# EAGLE design BehaviorShield-DB9-USB (EAGLE 9.2.2)
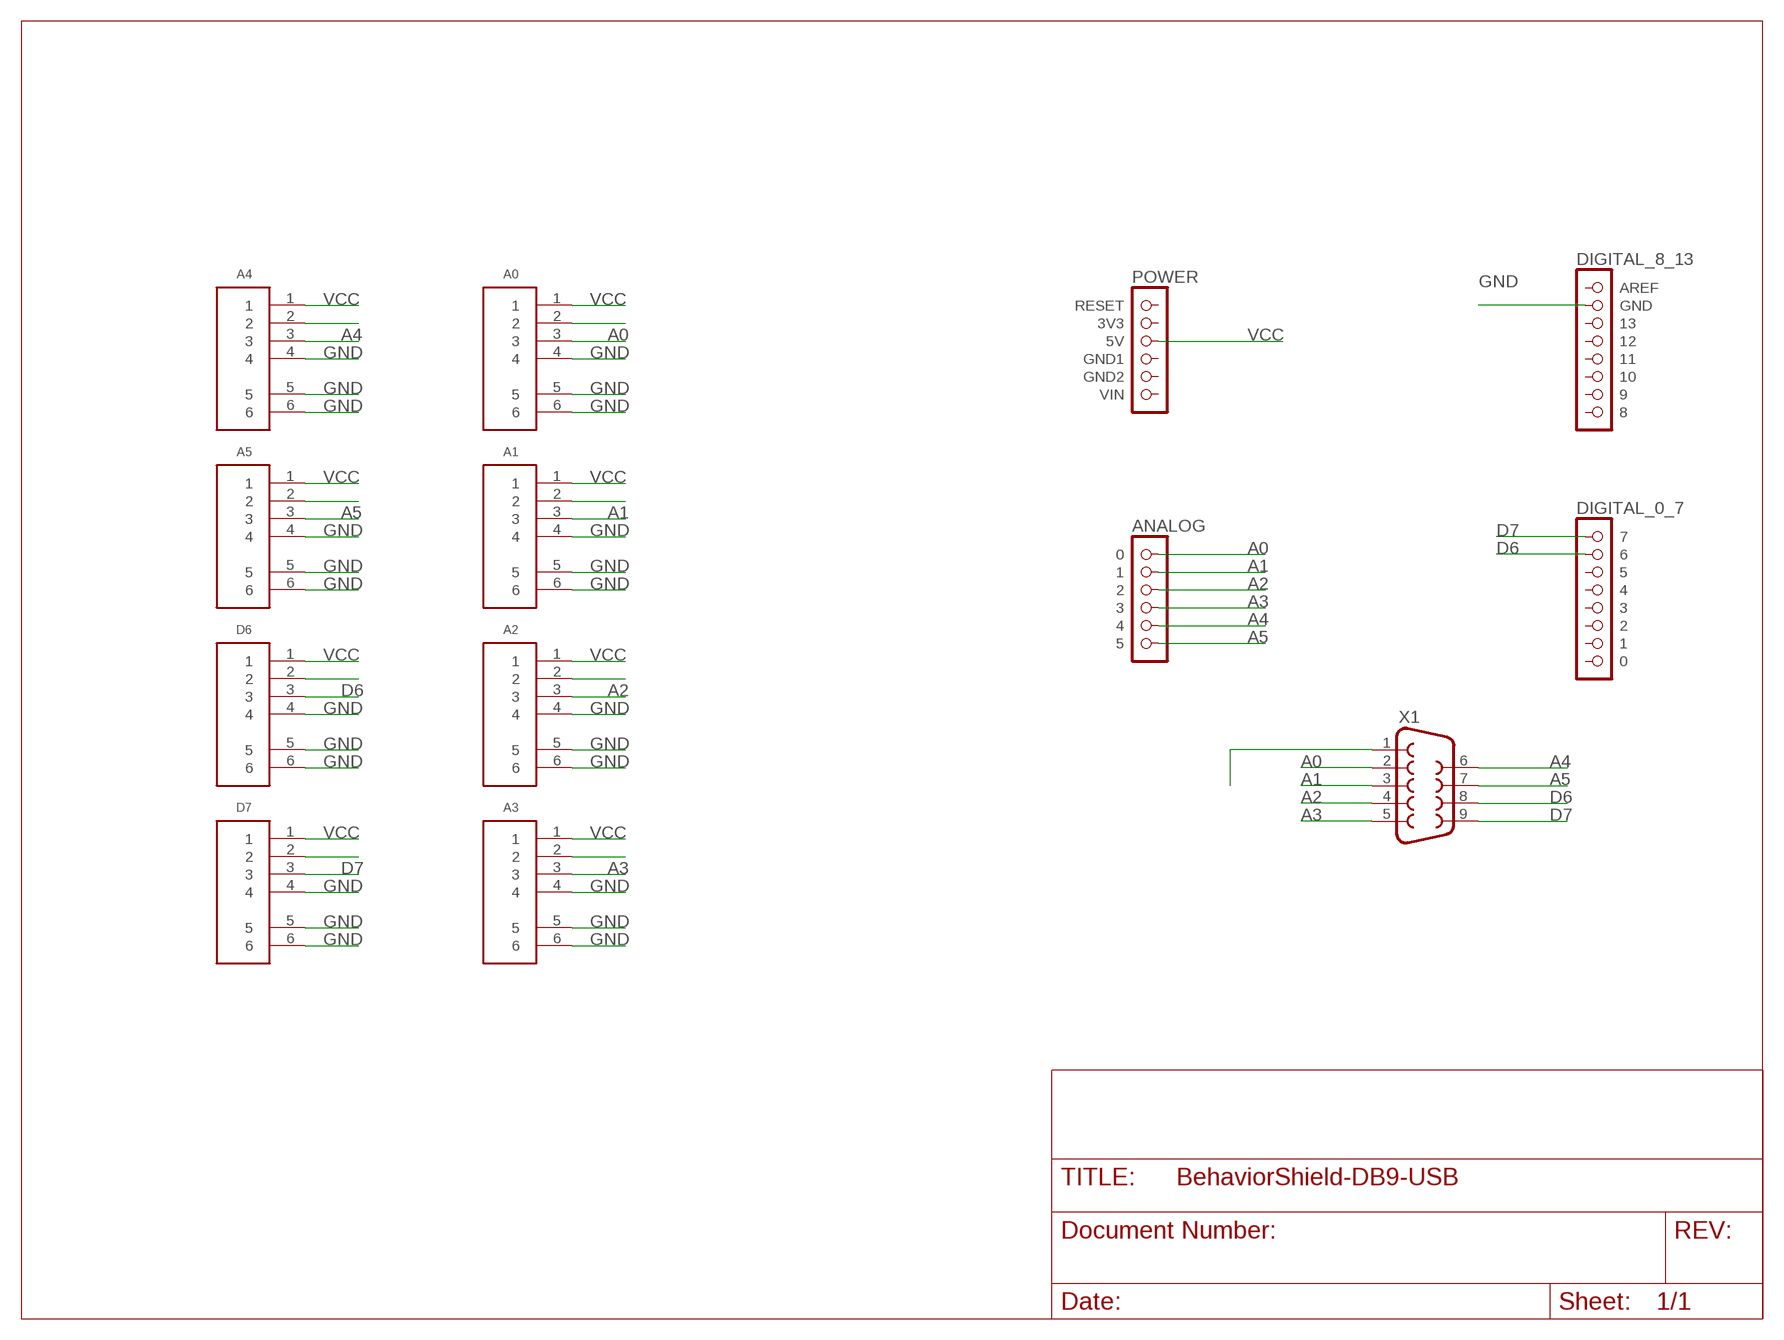
[diagram p0: schematic, sheet 1]

## Parts
A0  USB-A-S-X-X-TH  [USB-A-S-X-X-TH]
A1  USB-A-S-X-X-TH  [USB-A-S-X-X-TH]
A2  USB-A-S-X-X-TH  [USB-A-S-X-X-TH]
A3  USB-A-S-X-X-TH  [USB-A-S-X-X-TH]
A4  USB-A-S-X-X-TH  [USB-A-S-X-X-TH]
A5  USB-A-S-X-X-TH  [USB-A-S-X-X-TH]
D6  USB-A-S-X-X-TH  [USB-A-S-X-X-TH]
D7  USB-A-S-X-X-TH  [USB-A-S-X-X-TH]
U$1  POWER  [1X06]
U$2  ANALOG  [1X06]
U$3  DIGITAL_0_7  [1X08]
U$4  DIGITAL_8_13  [1X08]
X1  F09HP  [F09HP]

## Nets
A0: A0.3 U$2.1 X1.2
A1: A1.3 U$2.2 X1.3
A2: A2.3 U$2.3 X1.4
A3: A3.3 U$2.4 X1.5
A4: A4.3 U$2.5 X1.6
A5: A5.3 U$2.6 X1.7
D6: D6.3 U$3.2 X1.8
D7: D7.3 U$3.1 X1.9
GND: A0.4 A0.5 A0.6 A1.4 A1.5 A1.6 A2.4 A2.5 A2.6 A3.4 A3.5 A3.6 A4.4 A4.5 A4.6 A5.4 A5.5 A5.6 D6.4 D6.5 D6.6 D7.4 D7.5 D7.6 U$4.2(GND) X1.1
N$1: A1.2
N$2: A0.2
N$5: A2.2
N$7: A3.2
N$9: A4.2
N$11: A5.2
N$13: D6.2
N$15: D7.2
VCC: A0.1 A1.1 A2.1 A3.1 A4.1 A5.1 D6.1 D7.1 U$1.3(5V)
Unconnected: U$1.1(RESET) U$1.2(3V3) U$1.4(GND1) U$1.5(GND2) U$1.6(VIN) U$3.3 U$3.4 U$3.5 U$3.6 U$3.7 U$3.8 U$4.1(AREF) U$4.3 U$4.4 U$4.5 U$4.6 U$4.7 U$4.8

## Library data of the parts
A0 A1-A5 D6 D7 = USB-A-S-X-X-TH:USB-A-S-X-X-TH: USB-A, SINGLE THRU HOLE.
U$1 = arduino:POWER
U$2 = arduino:ANALOG
U$3 = arduino:DIGITAL_0_7
U$4 = arduino:DIGITAL_8_13
X1 = con-subd:F09: SUB-D; OC_FARNELL: unknown; OC_NEWARK: unknown

## Board
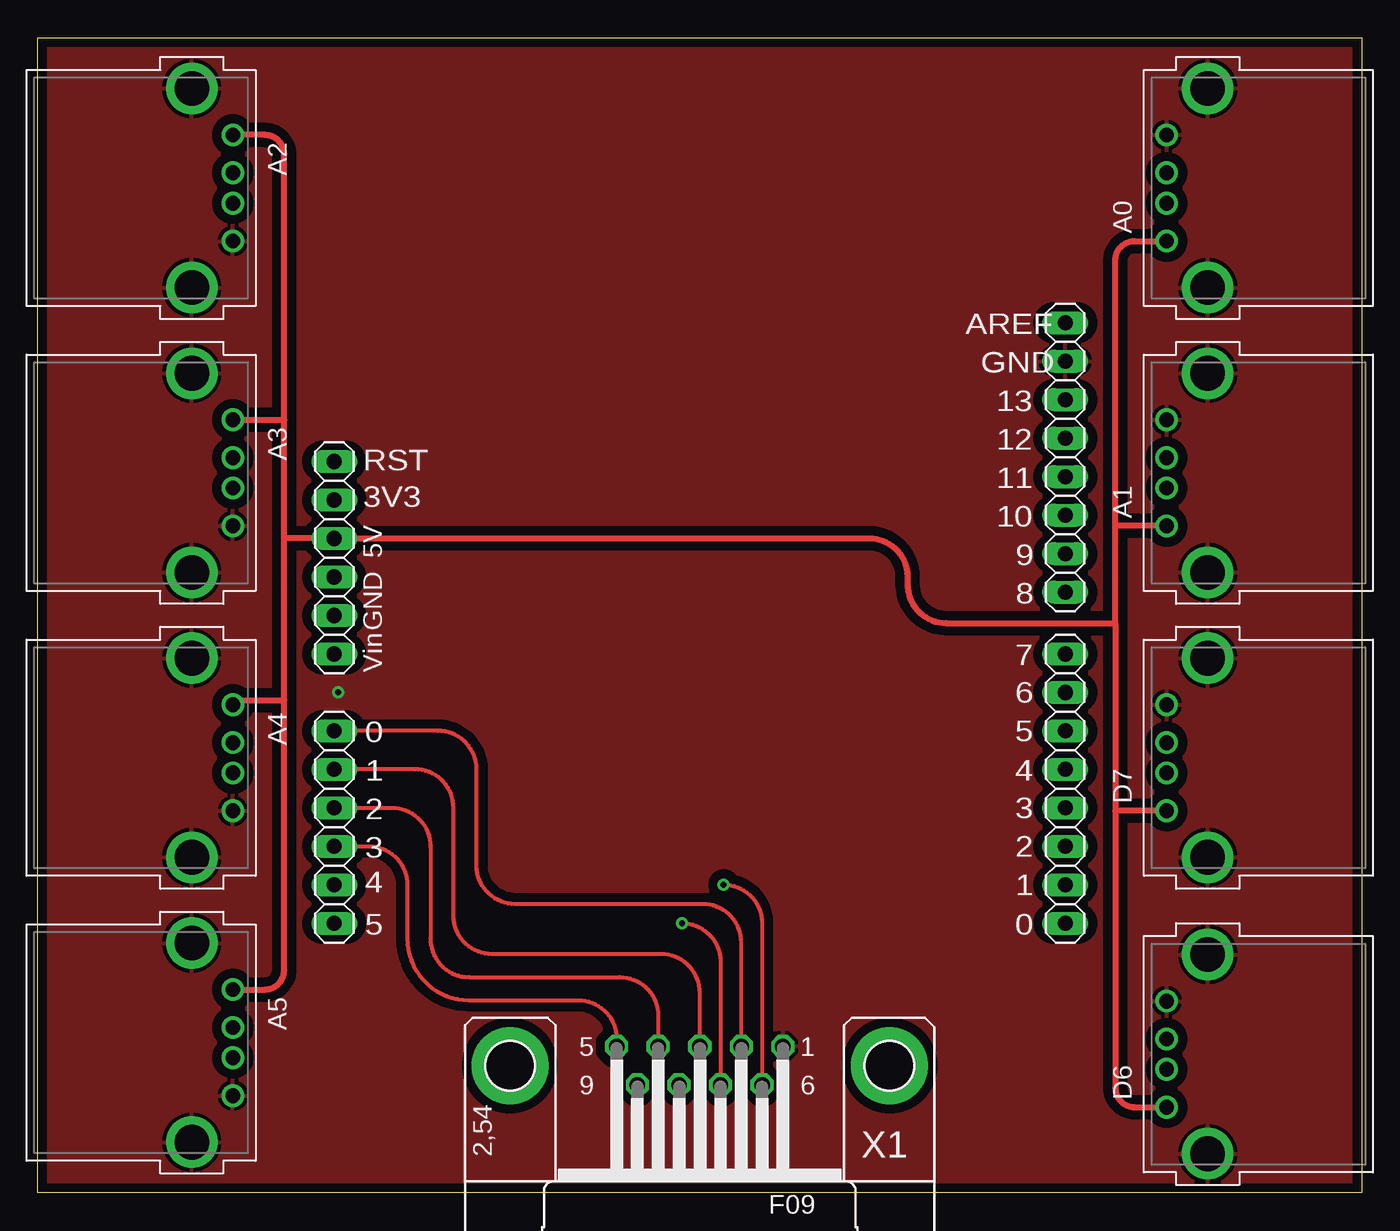
[diagram p1: board, top side]
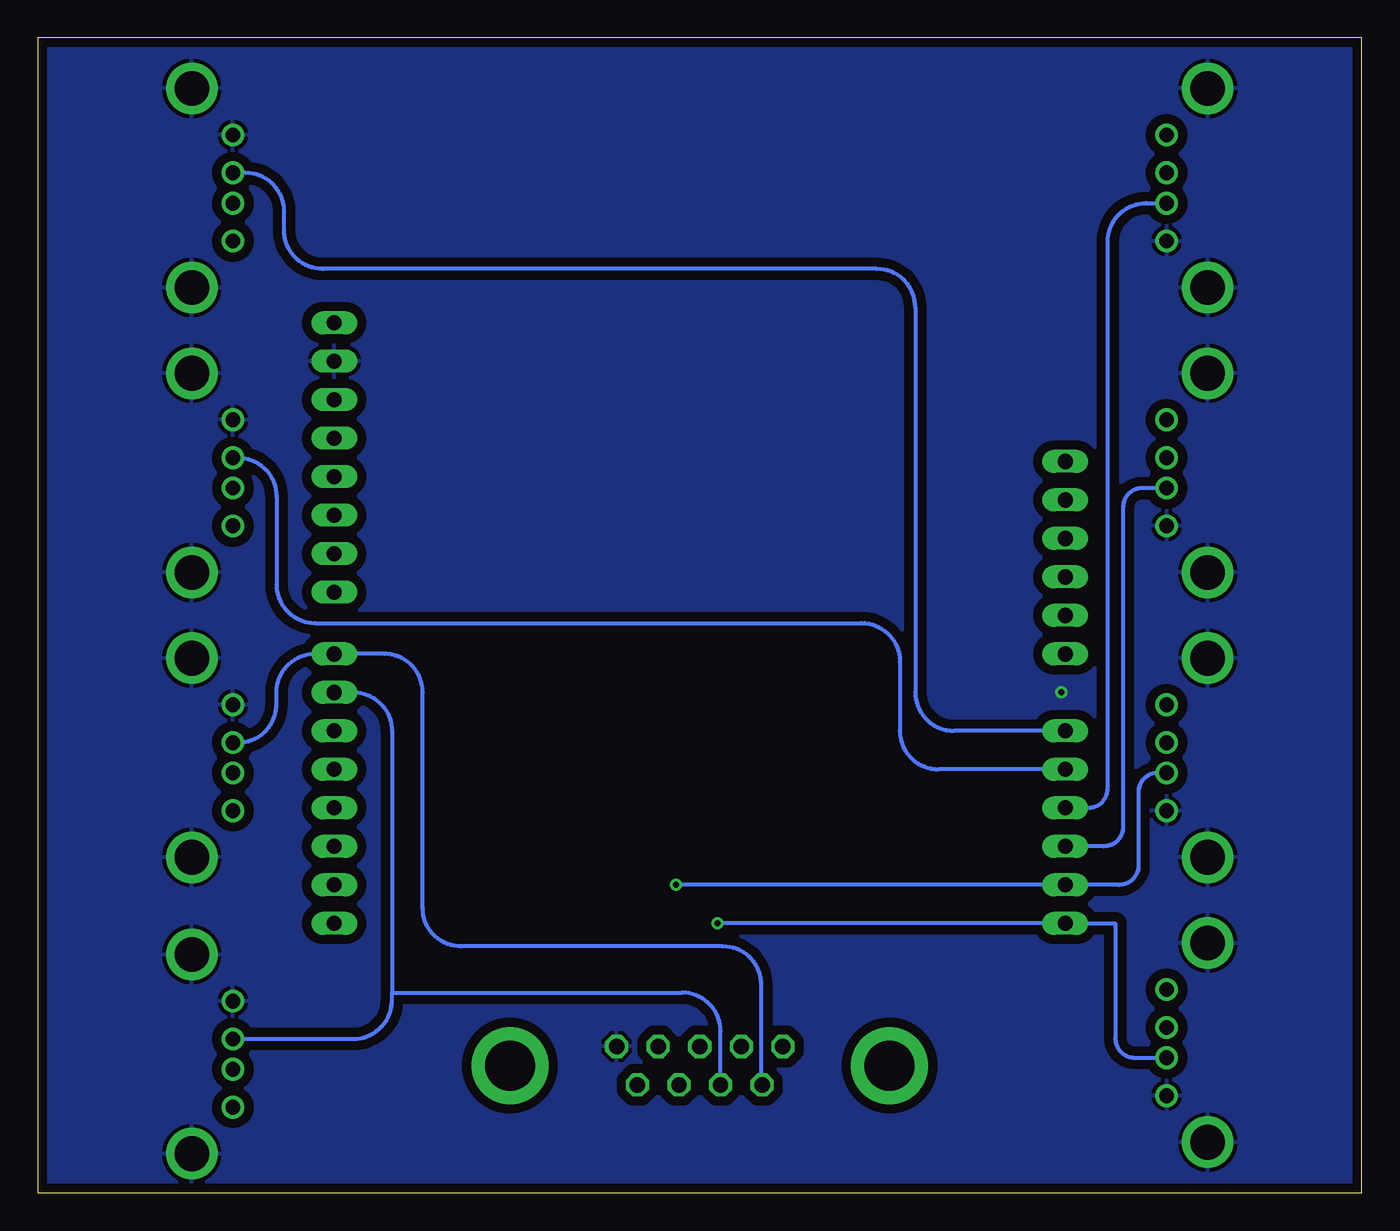
[diagram p2: board, bottom side, seen from below]

Size 87.38 x 76.2 mm. Coordinates in mm from the lower left corner, seen from the top.
Outline: 0,76.2 87.38,76.2 87.38,0 0,0 0,76.2
Copper layers (1*16): Top 0.035mm / dielectric 1.5mm / Bottom 0.035mm
Design rules "adafruit": minimum track width 8mil, minimum drill 15.5mil, track to track 8mil, track to pad 8mil, pad to pad 8mil, via to via 8mil, smd to smd 8mil, copper to edge 10mil, drill to drill 8mil, minimum pad ring 10mil, minimum via ring 8mil, stop-mask expansion 2mil, vias tented up to drill 20mil, thermal gap 10mil

### Footprints (pad centres in the part's own frame; a part is rotated, then mirrored left to right if it is on the bottom)
USB-A-S-X-X-TH = drill 0.98 pad 1.5: 1 -3.5,2.71; 2 -1,2.71; 3 1,2.71; 4 3.5,2.71 | drill 2.29 pad 3.4: 5 -6.57,0; 6 6.57,0
1X06 = drill 1.016 long: 1 -6.35,0; 2 -3.81,0; 3 -1.27,0; 4 1.27,0; 5 3.81,0; 6 6.35,0
1X08 = drill 1.016 long: 1 -8.89,0; 2 -6.35,0; 3 -3.81,0; 4 -1.27,0; 5 1.27,0; 6 3.81,0; 7 6.35,0; 8 8.89,0
F09HP = drill 1.016 octagon: 1 -5.486,-1.27; 2 -2.743,-1.27; 3 0,-1.27; 4 2.743,-1.27; 5 5.486,-1.27; 6 -4.115,1.27; 7 -1.372,1.27; 8 1.372,1.27; 9 4.115,1.27 | drill 3.302 pad 5.08: G1 -12.522,0; G2 12.522,0

### Placement (x,y rotation side)
A0  77.22,66.29 90 top
A1  77.22,47.5 90 top
A2  10.16,66.29 270 top
A3  10.16,47.5 270 top
A4  10.16,28.7 270 top
A5  10.16,9.91 270 top
D6  77.22,9.14 90 top
D7  77.22,28.7 90 top
U$1  19.56,41.91 270 top
U$2  19.56,24.13 270 top
U$3  67.82,26.67 270 top
U$4  67.82,48.51 270 top
X1  43.69,8.38 180 top

### Tracks (layer width: path | path; a pad name or v marks a point on that pad's centre or on a via)
A0
  Top 0.254: X1.2 46.43,16.51 arc90 43.89,19.05 31.5,19.05 arc-90 28.96,21.59 28.96,27.94 arc90 26.42,30.48 U$2.1
  Bottom 0.254: U$2.1 26.92,30.48 arc90 29.46,33.02 29.46,58.42 arc-90 32,60.96 68.58,60.96 arc90 71.12,63.5 71.12,64.75 arc-90 73.66,67.29 A0.3
A1
  Top 0.254: X1.3 43.69,13.21 arc90 41.15,15.75 29.97,15.75 arc-90 27.43,18.29 27.43,25.4 arc90 24.89,27.94 U$2.2
  Bottom 0.254: U$2.2 27.94,27.94 arc90 30.48,30.48 30.48,35.05 arc-90 33.02,37.59 69.09,37.59 arc90 71.63,40.13 71.63,45.96 arc-90 74.17,48.5 A1.3
A2
  Top 0.254: U$2.3 23.37,25.4 arc-90 25.91,22.86 25.91,16.76 arc90 28.45,14.22 38.41,14.22 arc-90 40.95,11.68 X1.4
  Bottom 0.254: U$2.3 18.03,25.4 arc-90 16.76,26.67 16.76,62.75 arc90 14.22,65.29 A2.3
A3
  Top 0.254: U$2.4 21.84,22.86 arc-90 24.38,20.32 24.38,16.76 arc90 28.45,12.7 35.66,12.7 arc-90 38.2,10.16 X1.5
  Bottom 0.254: A3.3 14.48,46.5 arc-90 15.75,45.23 15.75,24.13 arc90 17.02,22.86 U$2.4
A4  (via drill 0.39)
  Top 0.254: v45.26,20.32 arc-90 47.8,17.78 X1.6
  Bottom 0.254: v45.26,20.32 U$2.5 16,20.32 arc-90 14.73,21.59 14.73,26.43 arc90 13.46,27.7 A4.3
A5  (via drill 0.39)
  Top 0.254: v42.52,17.78 arc-90 45.06,15.24 X1.7
  Bottom 0.254: v42.52,17.78 U$2.6 16.26,17.78 16.26,10.18 arc-90 14.99,8.91 A5.3
D6
  Bottom 0.254: X1.8 42.32,10.67 arc-90 44.86,13.21 64.01,13.21 | U$3.2 66.55,33.02 arc90 64.01,30.48 64.01,13.21 | D6.3 66.55,10.14 arc-90 64.01,12.68 64.01,13.21
D7
  Bottom 0.254: X1.9 39.62,7.11 39.62,13.72 arc-90 42.16,16.26 59.44,16.26 arc90 61.98,18.8 61.98,33.02 arc-90 64.52,35.56 U$3.1 69.09,35.56 arc-90 71.63,33.02 71.63,32.24 arc90 74.17,29.7 D7.3
GND  (via drill 0.39)
  other vias: 19.81,33.02
  pour Bottom (isolate 0.61): 0,76.2 87.38,76.2 87.38,0 0,0
  pour Top (isolate 0.61): 0,76.2 87.38,76.2 87.38,0 0,0
VCC
  Top 0.406: 71.12,37.59 59.94,37.59 arc-90 57.4,40.13 57.4,40.64 arc90 54.86,43.18 U$1.3 16.26,43.18 | 16.26,43.18 16.26,51 | 16.26,51 16.26,68.52 arc90 14.99,69.79 A2.1 | 71.12,44 71.12,61.52 arc-90 72.39,62.79 A0.1 | 71.12,37.59 71.12,44 | A1.1 71.12,44 | A5.1 14.99,13.41 arc90 16.26,14.68 16.26,32.51 | 16.26,32.51 16.26,43.18 | A3.1 16.26,51 | A4.1 12.87,32.51 16.26,32.51 | 71.12,25.2 71.12,6.91 arc90 72.39,5.64 D6.1 | 71.12,37.59 71.12,25.2 | D7.1 71.12,25.2

### Text on the board
tNames: AREF | GND | 13 | 12 | RST | 11 | 3V3 | 5V | 10 | GND | 9 | 8 | Vin | 7 | 6 | 0 | 5 | 1 | 4 | 2 | 3 | 3 | 2 | 4 | 1 | 5 | 0
tDocu: Behavior Shield + | V 3.0 Kemere Lab 2019 | Shield=GND / Ring=Signal / Tip=5V